# Altium schematic sheet TAUV-Disconnect.SchDoc
size A
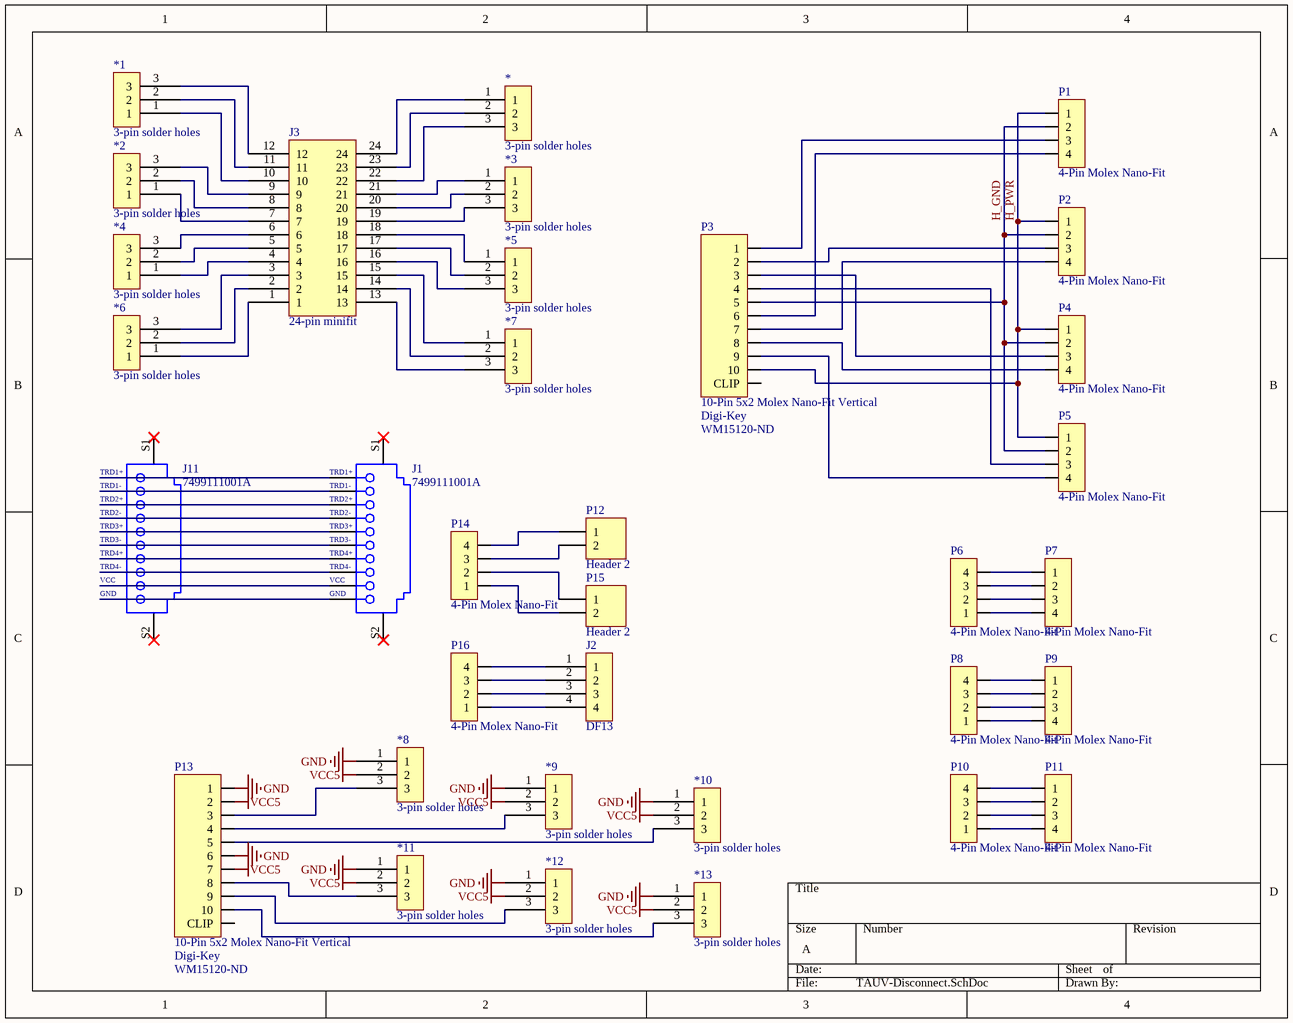
[diagram p0: TAUV-Disconnect.SchDoc]

## Parts
*  3-pin solder holes  [3-PIN SOLDER HOLES]
*1  3-pin solder holes  [3-PIN SOLDER HOLES]
*2  3-pin solder holes  [3-PIN SOLDER HOLES]
*3  3-pin solder holes  [3-PIN SOLDER HOLES]
*4  3-pin solder holes  [3-PIN SOLDER HOLES]
*5  3-pin solder holes  [3-PIN SOLDER HOLES]
*6  3-pin solder holes  [3-PIN SOLDER HOLES]
*7  3-pin solder holes  [3-PIN SOLDER HOLES]
*8  3-pin solder holes  [3-PIN SOLDER HOLES - small]
*9  3-pin solder holes  [3-PIN SOLDER HOLES - small]
*10  3-pin solder holes  [3-PIN SOLDER HOLES - small]
*11  3-pin solder holes  [3-PIN SOLDER HOLES - small]
*12  3-pin solder holes  [3-PIN SOLDER HOLES - small]
*13  3-pin solder holes  [3-PIN SOLDER HOLES - small]
J1  7499111001A  [WE-7499111001A_V]
J2  DF13  [4-pin DF13 vertical smd]
J3  24-pin minifit  [24-PIN MINIFIT VERT]
J11  7499111001A  [WE-7499111001A_V]
P1  4-Pin Molex Nano-Fit  [MOLEX NANO-FIT 1X4 - Vertical]
P2  4-Pin Molex Nano-Fit  [MOLEX NANO-FIT 1X4 - Vertical]
P3  10-Pin 5x2 Molex Nano-Fit Vertical  Supplier 1: Digi-Key  Supplier Part Number 1: WM15120-ND  [MOLEX NANO-FIT 2x5 - Vertical]
P4  4-Pin Molex Nano-Fit  [MOLEX NANO-FIT 1X4 - Vertical]
P5  4-Pin Molex Nano-Fit  [MOLEX NANO-FIT 1X4 - Vertical]
P6  4-Pin Molex Nano-Fit  [MOLEX NANO-FIT 1X4 - Vertical]
P7  4-Pin Molex Nano-Fit  [MOLEX NANO-FIT 1X4 - Vertical]
P8  4-Pin Molex Nano-Fit  [MOLEX NANO-FIT 1X4 - Vertical]
P9  4-Pin Molex Nano-Fit  [MOLEX NANO-FIT 1X4 - Vertical]
P10  4-Pin Molex Nano-Fit  [MOLEX NANO-FIT 1X4 - Vertical]
P11  4-Pin Molex Nano-Fit  [MOLEX NANO-FIT 1X4 - Vertical]
P12  Header 2  [HDR1X2]
P13  10-Pin 5x2 Molex Nano-Fit Vertical  Supplier 1: Digi-Key  Supplier Part Number 1: WM15120-ND  [MOLEX NANO-FIT 2x5 - Vertical]
P14  4-Pin Molex Nano-Fit  [MOLEX NANO-FIT 1X4 - Vertical]
P15  Header 2  [HDR1X2]
P16  4-Pin Molex Nano-Fit  [MOLEX NANO-FIT 1X4 - Vertical]

## Nets
GND: *8.1 *9.1 *10.1 *11.1 *12.1 *13.1 P13.1 P13.6
VCC5: *8.2 *9.2 *10.2 *11.2 *12.2 *13.2 P13.2 P13.7
H_GND: P1.2 P2.2 P3.5 P4.2 P5.2
H_PWR: P1.1 P2.1 P3.10 P4.1 P5.1
Net*1_1: *1.1 J3.10
Net*1_2: *1.2 J3.11
Net*1_3: *1.3 J3.12
Net*2_1: *2.1 J3.7
Net*2_2: *2.2 J3.8
Net*2_3: *2.3 J3.9
Net*3_1: *3.1 J3.21
Net*3_2: *3.2 J3.20
Net*3_3: *3.3 J3.19
Net*4_1: *4.1 J3.4
Net*4_2: *4.2 J3.5
Net*4_3: *4.3 J3.6
Net*5_1: *5.1 J3.18
Net*5_2: *5.2 J3.17
Net*5_3: *5.3 J3.16
Net*6_1: *6.1 J3.1
Net*6_2: *6.2 J3.2
Net*6_3: *6.3 J3.3
Net*7_1: *7.1 J3.15
Net*7_2: *7.2 J3.14
Net*7_3: *7.3 J3.13
Net*8_3: *8.3 P13.3
Net*9_3: *9.3 P13.4
Net*10_3: *10.3 P13.5
Net*11_3: *11.3 P13.8
Net*12_3: *12.3 P13.9
Net*13_3: *13.3 P13.10
Net*_1: *.1 J3.24
Net*_2: *.2 J3.23
Net*_3: *.3 J3.22
NetJ1_1: J1.1(TRD1+) J11.1(TRD1+)
NetJ1_2: J1.2(TRD1-) J11.2(TRD1-)
NetJ1_3: J1.3(TRD2+) J11.3(TRD2+)
NetJ1_4: J1.4(TRD2-) J11.4(TRD2-)
NetJ1_5: J1.5(TRD3+) J11.5(TRD3+)
NetJ1_6: J1.6(TRD3-) J11.6(TRD3-)
NetJ1_7: J1.7(TRD4+) J11.7(TRD4+)
NetJ1_8: J1.8(TRD4-) J11.8(TRD4-)
NetJ1_9: J1.9(VCC) J11.9(VCC)
NetJ1_10: J1.10(GND) J11.10(GND)
NetJ2_1: J2.1 P16.4
NetJ2_2: J2.2 P16.3
NetJ2_3: J2.3 P16.2
NetJ2_4: J2.4 P16.1
NetP1_3: P1.3 P3.1
NetP1_4: P1.4 P3.6
NetP2_3: P2.3 P3.2
NetP2_4: P2.4 P3.7
NetP3_3: P3.3 P4.3
NetP3_4: P3.4 P5.3
NetP3_8: P3.8 P4.4
NetP3_9: P3.9 P5.4
NetP6_1: P6.1 P7.4
NetP6_2: P6.2 P7.3
NetP6_3: P6.3 P7.2
NetP6_4: P6.4 P7.1
NetP8_1: P8.1 P9.4
NetP8_2: P8.2 P9.3
NetP8_3: P8.3 P9.2
NetP8_4: P8.4 P9.1
NetP10_1: P10.1 P11.4
NetP10_2: P10.2 P11.3
NetP10_3: P10.3 P11.2
NetP10_4: P10.4 P11.1
NetP12_1: P12.1 P14.4
NetP12_2: P12.2 P14.3
NetP14_1: P14.1 P15.2
NetP14_2: P14.2 P15.1

Not connected (* = marked no-connect by the designer): J1 S1(SHLD)* S2(SHLD)*; J11 S1(SHLD)* S2(SHLD)*; P3 11(CLIP); P13 11(CLIP)

## Library data of the parts
J1 J11 = CMP-1710-00001-3: RJ45 LAN Transformer, Modular JACK, 0 to 70 degC, 10-Pin THD, RoHS, Tube; Mounting Technology: Through Hole; ComponentLink1URL: https://www.we-online.com/; ComponentLink2Description: Datasheet; ComponentLink2URL: https://katalog.we-online.de/pbs/datasheet/7499111001A.pdf; RoHSCompliant: False; ComponentLink1Description: Manufacturer URL; DatasheetVersion: Rev. 01; PackageDescription: 10-Pin Through Hole Device, Body 21.84 x 16 mm; PartNumber: 7499111001A
J2 = 4-pin DF13 vertical smd: H126000CT-ND
J3 = 24-pin minifit RA: RA: WM21362-ND / VERT: WM3811-ND
P1 P2 P4-P11 P14 P16 = 4-Pin Nano-Fit Throughole Vertical: NanoFit ST Hdr TH SR 4Ckt; Part Number: 105313-1204; Supplier: Mouser; Manufacturer: Molex; Supplier Part Number: 538-105313-1204
P3 P13 = 10-Pin 2-Row Nano-Fit_Vertical: NanoFit VT Hdr TH DR 10Ckt; Part Number: 105314-1216; Supplier: Digi-Key; Manufacturer: Molex; Supplier Part Number: WM15165-ND; ComponentLink1Description: Digikey Link; ComponentLink1URL: https://www.digikey.com/product-detail/en/molex-llc/1053121310/WM15120-ND/6164209
P12 P15 = Header 2: Header, 2-Pin; LatestRevisionDate: 17-Jul-2002; LatestRevisionNote: Re-released for DXP Platform.; Publisher: Altium Limited